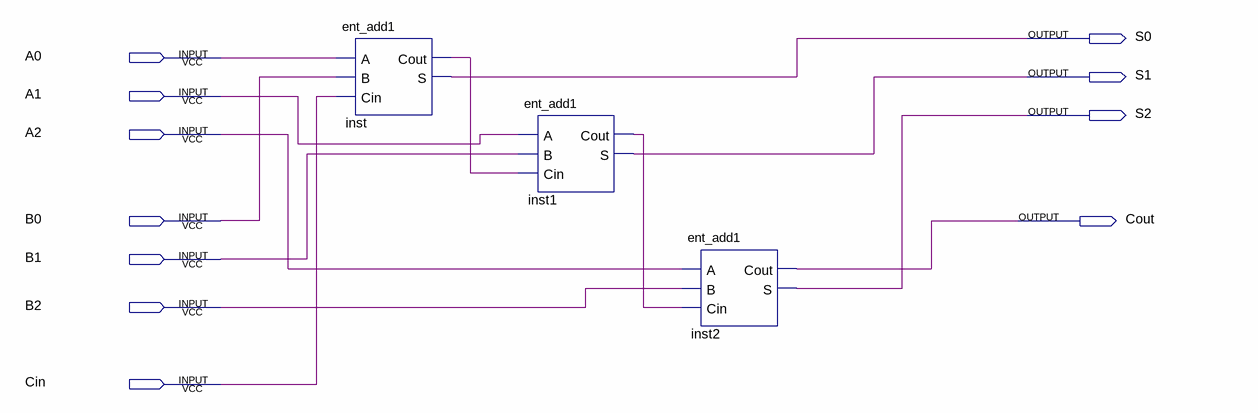
[diagram p0: schematic sheet]
// Quartus schematic add1_.bdf as structural Verilog: 3 symbols, 11 pins
module add1_ (
  input  A0,
  input  A1,
  input  A2,
  input  B0,
  input  B1,
  input  B2,
  input  Cin,
  output S0,
  output S1,
  output S2,
  output Cout
);

  wire inst1_cout, inst_cout;

  ent_add1 inst (.A(A0), .B(B0), .Cin(Cin), .Cout(inst_cout), .S(S0));
  ent_add1 inst1 (.A(A1), .B(B1), .Cin(inst_cout), .Cout(inst1_cout), .S(S1));
  ent_add1 inst2 (.A(A2), .B(B2), .Cin(inst1_cout), .Cout(Cout), .S(S2));
endmodule
